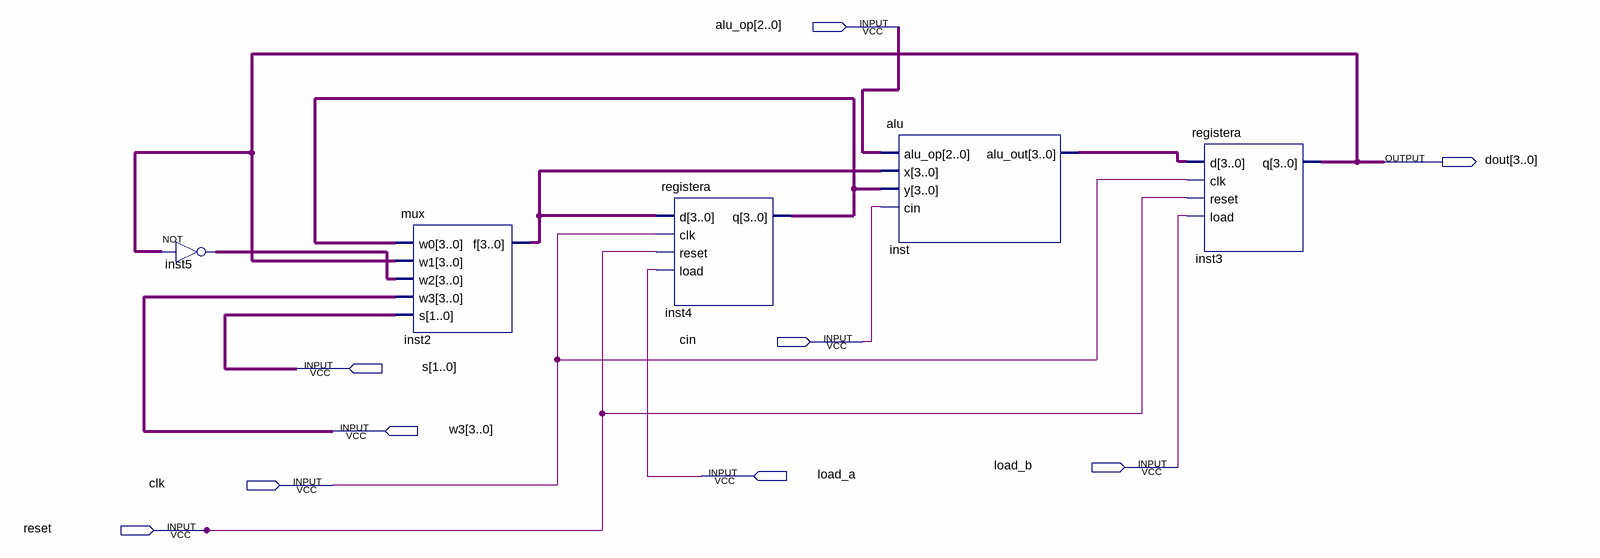
[diagram p0: schematic sheet]
// Quartus schematic datapath.bdf as structural Verilog: 5 symbols, 9 pins
module datapath (
  input  [2:0] alu_op,
  input  cin,
  input  [1:0] s,
  input  [3:0] w3,
  input  load_b,
  input  load_a,
  input  clk,
  input  reset,
  output [3:0] dout
);

  wire [3:0] inst2_f, inst4_q, inst5_out, inst_alu_out;

  assign inst5_out = ~dout;  // NOT inst5, 4 bits wide
  mux inst2 (.w0(inst4_q), .w1(dout), .w2(inst5_out), .w3(w3), .s(s), .f(inst2_f));
  registera inst4 (.d(inst2_f), .clk(clk), .reset(reset), .load(load_a), .q(inst4_q));
  alu inst (.alu_op(alu_op), .x(inst2_f), .y(inst4_q), .cin(cin), .alu_out(inst_alu_out));
  registera inst3 (.d(inst_alu_out), .clk(clk), .reset(reset), .load(load_b), .q(dout));
endmodule
